# Altium schematic sheet UVW_Mosfets.SchDoc
size A4; SheetNumber: 2; SheetTotal: 6
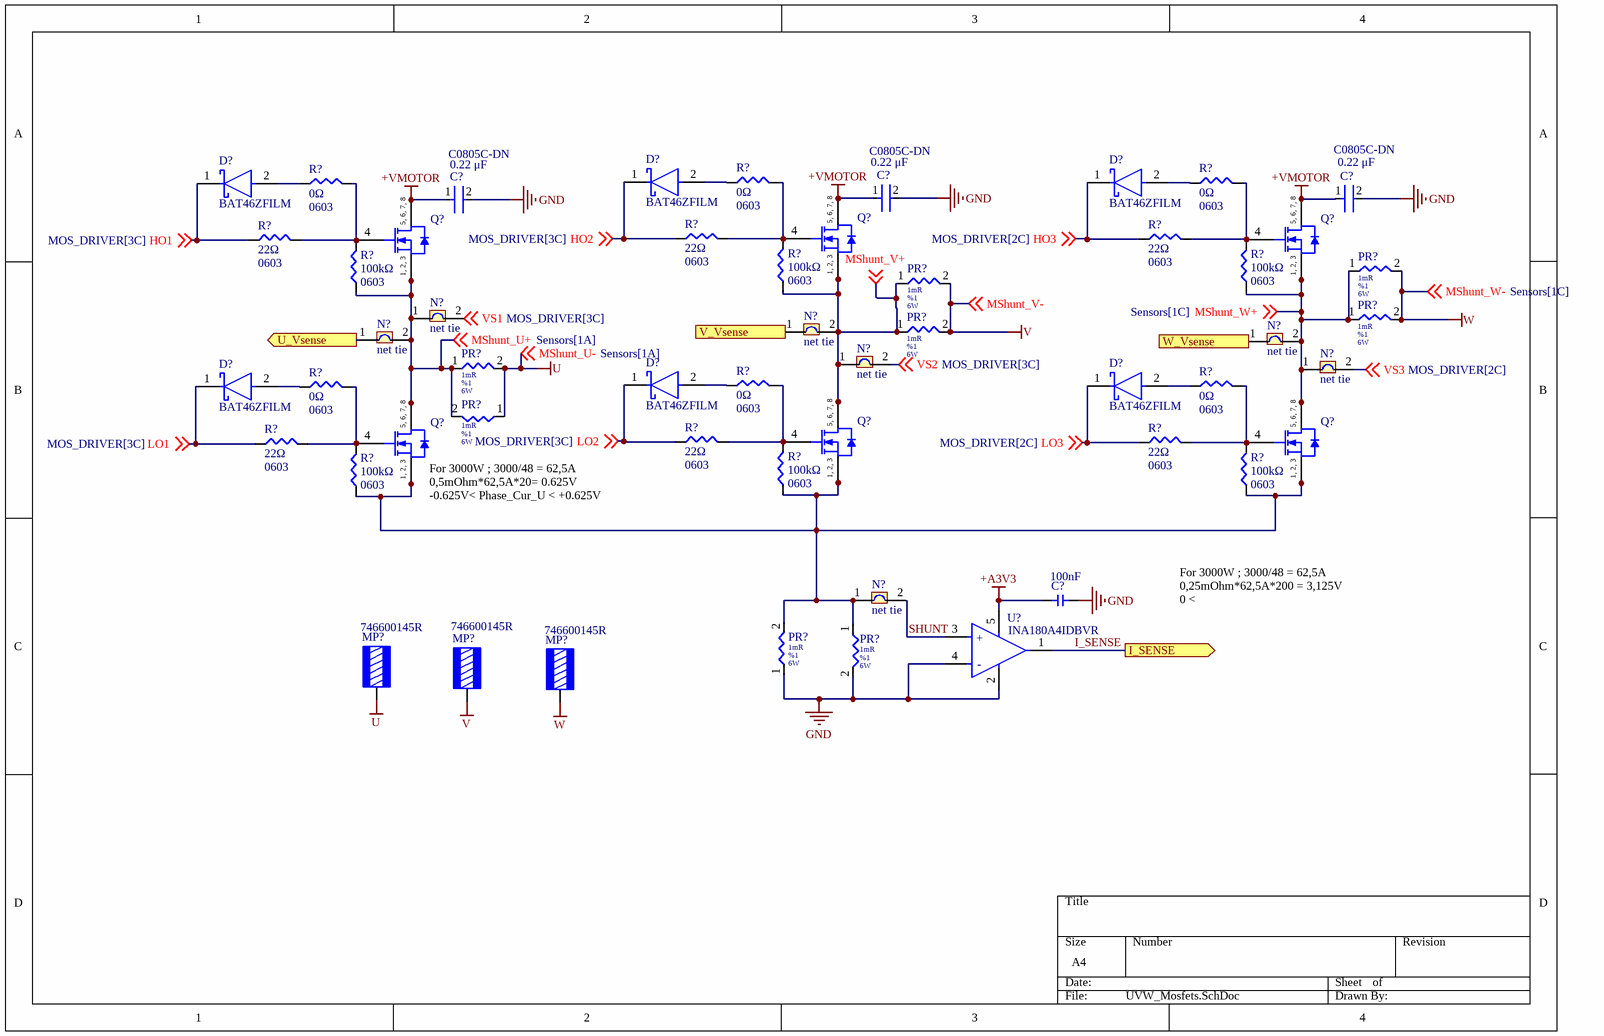
[diagram p0: UVW_Mosfets.SchDoc]

## Parts
(Parts that share a designator on the sheet are numbered #1, #2 ... from top to bottom, then left to right.)
C?#1  value 0.22 μF  Package: C0805C-DN  [FP-C0805C-DN-IPC_A]  (hidden comment: C0805C224K1RACTU)
C?#2  value 0.22 μF  Package: C0805C-DN  [FP-C0805C-DN-IPC_A]  (hidden comment: C0805C224K1RACTU)
C?#3  value 0.22 μF  Package: C0805C-DN  [FP-C0805C-DN-IPC_A]  (hidden comment: C0805C224K1RACTU)
C?#4  value 100nF  [0603_cap]  (hidden comment: 0603_100nF)
D?#1  BAT46ZFILM  [FP-SOD-123-MFG]
D?#2  BAT46ZFILM  [FP-SOD-123-MFG]
D?#3  BAT46ZFILM  [FP-SOD-123-MFG]
D?#4  BAT46ZFILM  [FP-SOD-123-MFG]
D?#5  BAT46ZFILM  [FP-SOD-123-MFG]
D?#6  BAT46ZFILM  [FP-SOD-123-MFG]
MP?#1  746600145R  [746600145]
MP?#2  746600145R  [746600145]
MP?#3  746600145R  [746600145]
N?#1  net tie  [net tie]  (net tie, no BOM)
N?#2  net tie  [net tie]  (net tie, no BOM)
N?#3  net tie  [net tie]  (net tie, no BOM)
N?#4  net tie  [net tie]  (net tie, no BOM)
N?#5  net tie  [net tie]  (net tie, no BOM)
N?#6  net tie  [net tie]  (net tie, no BOM)
N?#7  net tie  [net tie]  (net tie, no BOM)
PR?#1  value 1mR  Tolerance: %1  Power: 6W  [SMT-2512]  (hidden comment: EBWM2512F1L00S9)
PR?#2  value 1mR  Tolerance: %1  Power: 6W  [SMT-2512]  (hidden comment: EBWM2512F1L00S9)
PR?#3  value 1mR  Tolerance: %1  Power: 6W  [SMT-2512]  (hidden comment: EBWM2512F1L00S9)
PR?#4  value 1mR  Tolerance: %1  Power: 6W  [SMT-2512]  (hidden comment: EBWM2512F1L00S9)
PR?#5  value 1mR  Tolerance: %1  Power: 6W  [SMT-2512]  (hidden comment: EBWM2512F1L00S9)
PR?#6  value 1mR  Tolerance: %1  Power: 6W  [SMT-2512]  (hidden comment: EBWM2512F1L00S9)
PR?#7  value 1mR  Tolerance: %1  Power: 6W  [SMT-2512]  (hidden comment: EBWM2512F1L00S9)
PR?#8  value 1mR  Tolerance: %1  Power: 6W  [SMT-2512]  (hidden comment: EBWM2512F1L00S9)
Q?#1  TPH2R608NH,L1Q  [SOP Advance_TOS-L]  (value not drawn)
Q?#2  TPH2R608NH,L1Q  [SOP Advance_TOS-L]  (value not drawn)
Q?#3  TPH2R608NH,L1Q  [SOP Advance_TOS-L]  (value not drawn)
Q?#4  TPH2R608NH,L1Q  [SOP Advance_TOS-L]  (value not drawn)
Q?#5  TPH2R608NH,L1Q  [SOP Advance_TOS-L]  (value not drawn)
Q?#6  TPH2R608NH,L1Q  [SOP Advance_TOS-L]  (value not drawn)
R?#1  value 0Ω  Package: 0603  [0603-smd]  (hidden comment: 0603_0R)
R?#2  value 0Ω  Package: 0603  [0603-smd]  (hidden comment: 0603_0R)
R?#3  value 0Ω  Package: 0603  [0603-smd]  (hidden comment: 0603_0R)
R?#4  value 22Ω  Package: 0603  [0603-smd]  (hidden comment: 0603_22R)
R?#5  value 22Ω  Package: 0603  [0603-smd]  (hidden comment: 0603_22R)
R?#6  value 22Ω  Package: 0603  [0603-smd]  (hidden comment: 0603_22R)
R?#7  value 100kΩ  Package: 0603  [0603-smd]  (hidden comment: 0603_100K)
R?#8  value 100kΩ  Package: 0603  [0603-smd]  (hidden comment: 0603_100K)
R?#9  value 100kΩ  Package: 0603  [0603-smd]  (hidden comment: 0603_100K)
R?#10  value 0Ω  Package: 0603  [0603-smd]  (hidden comment: 0603_0R)
R?#11  value 0Ω  Package: 0603  [0603-smd]  (hidden comment: 0603_0R)
R?#12  value 0Ω  Package: 0603  [0603-smd]  (hidden comment: 0603_0R)
R?#13  value 22Ω  Package: 0603  [0603-smd]  (hidden comment: 0603_22R)
R?#14  value 22Ω  Package: 0603  [0603-smd]  (hidden comment: 0603_22R)
R?#15  value 22Ω  Package: 0603  [0603-smd]  (hidden comment: 0603_22R)
R?#16  value 100kΩ  Package: 0603  [0603-smd]  (hidden comment: 0603_100K)
R?#17  value 100kΩ  Package: 0603  [0603-smd]  (hidden comment: 0603_100K)
R?#18  value 100kΩ  Package: 0603  [0603-smd]  (hidden comment: 0603_100K)
U?  INA180A4IDBVR  [FP-DBV0005A-IPC_A]

## Ports
I_SENSE (out), U_Vsense (out), V_Vsense (out), W_Vsense (out)

## Nets
+A3V3: C?#4.1 U?.5(VS)
+VMOTOR: C?#1.1 C?#2.1 C?#3.1 Q?#1.5(DRAIN) Q?#1.6(DRAIN) Q?#1.7(DRAIN) Q?#1.8(DRAIN) Q?#2.5(DRAIN) Q?#2.6(DRAIN) Q?#2.7(DRAIN) Q?#2.8(DRAIN) Q?#3.5(DRAIN) Q?#3.6(DRAIN) Q?#3.7(DRAIN) Q?#3.8(DRAIN)
GND: C?#1.2 C?#2.2 C?#3.2 C?#4.2 PR?#7.2 PR?#8.1 U?.2(GND) U?.4(IN-)
U: MP?#1.1 PR?#5.2 PR?#6.1 ; off-sheet MShunt_U-  [also labelled MShunt_U-]
V: MP?#2.1 PR?#2.2 PR?#4.2 ; off-sheet MShunt_V-  [also labelled MShunt_V-]
W: MP?#3.1 PR?#1.2 PR?#3.2 ; off-sheet MShunt_W-  [also labelled MShunt_W-]
HO1: D?#1.1(C) R?#4.1 ; off-sheet HO1
HO2: D?#2.1(C) R?#5.1 ; off-sheet HO2
HO3: D?#3.1(C) R?#6.1 ; off-sheet HO3
I_SENSE: U?.1(OUT) ; port I_SENSE
LO1: D?#6.1(C) R?#13.1 ; off-sheet LO1
LO2: D?#4.1(C) R?#14.1 ; off-sheet LO2
LO3: D?#5.1(C) R?#15.1 ; off-sheet LO3
MShunt_U+: N?#1.1 N?#3.2 PR?#5.1 PR?#6.2 Q?#1.1(SOURCE) Q?#1.2(SOURCE) Q?#1.3(SOURCE) Q?#4.5(DRAIN) Q?#4.6(DRAIN) Q?#4.7(DRAIN) Q?#4.8(DRAIN) R?#7.1 ; off-sheet MShunt_U+
MShunt_V+: N?#2.2 N?#5.1 PR?#2.1 PR?#4.1 Q?#2.1(SOURCE) Q?#2.2(SOURCE) Q?#2.3(SOURCE) Q?#5.5(DRAIN) Q?#5.6(DRAIN) Q?#5.7(DRAIN) Q?#5.8(DRAIN) R?#8.1 ; off-sheet MShunt_V+
MShunt_W+: N?#4.2 N?#6.1 PR?#1.1 PR?#3.1 Q?#3.1(SOURCE) Q?#3.2(SOURCE) Q?#3.3(SOURCE) Q?#6.5(DRAIN) Q?#6.6(DRAIN) Q?#6.7(DRAIN) Q?#6.8(DRAIN) R?#9.1 ; off-sheet MShunt_W+
SHUNT: U?.3(IN+)
U_Vsense: N?#3.1 ; port U_Vsense
V_Vsense: N?#2.1 ; port V_Vsense
VS1: N?#1.2 ; off-sheet VS1
VS2: N?#5.2 ; off-sheet VS2
VS3: N?#6.2 ; off-sheet VS3
W_Vsense: N?#4.1 ; port W_Vsense
NetD?#1_2: D?#1.2(A) R?#1.1
NetD?#2_2: D?#2.2(A) R?#2.1
NetD?#3_2: D?#3.2(A) R?#3.1
NetD?#4_2: D?#4.2(A) R?#10.1
NetD?#5_2: D?#5.2(A) R?#11.1
NetD?#6_2: D?#6.2(A) R?#12.1
NetN?#7_1: N?#7.1 PR?#7.1 PR?#8.2 Q?#4.1(SOURCE) Q?#4.2(SOURCE) Q?#4.3(SOURCE) Q?#5.1(SOURCE) Q?#5.2(SOURCE) Q?#5.3(SOURCE) Q?#6.1(SOURCE) Q?#6.2(SOURCE) Q?#6.3(SOURCE) R?#16.1 R?#17.1 R?#18.1
NetQ?#1_4: Q?#1.4(GATE) R?#1.2 R?#4.2 R?#7.2
NetQ?#2_4: Q?#2.4(GATE) R?#2.2 R?#5.2 R?#8.2
NetQ?#3_4: Q?#3.4(GATE) R?#3.2 R?#6.2 R?#9.2
NetQ?#4_4: Q?#4.4(GATE) R?#12.2 R?#13.2 R?#16.2
NetQ?#5_4: Q?#5.4(GATE) R?#10.2 R?#14.2 R?#17.2
NetQ?#6_4: Q?#6.4(GATE) R?#11.2 R?#15.2 R?#18.2

Not connected (* = marked no-connect by the designer): N?#7 2

## Notes on the sheet
- (near Q?#4) For 3000W ; 3000/48 = 62,5A
  0,5mOhm*62,5A*20= 0.625V
  -0.625V< Phase_Cur_U < +0.625V
- For 3000W ; 3000/48 = 62,5A
  0,25mOhm*62,5A*200 = 3,125V
  0 < @{"Id":"UGEDVJUL\KTVDSUUQ"} < 3,125V
- (in symbol CMP-04895-000244-1) +; -
- (in symbol TPH2R608NH,L1Q) 5, 6, 7, 8; 1, 2, 3

## Library data of the parts
C?#1-C?#3 = CMP-2007-03262-2: CAP CER 0.22UF 100V 10% X7R 0805; Manufacturer: KEMET; Material: Ceramic; Tolerance: 0.1; Temperature Coefficient: 30ppm/°C; Temperature Range High: +125°C; Temperature Range Low: -55°C; Voltage Rating: 100 V; Device Class L2: Capacitors; Manufacturer Part Number: C0805C224K1RACTU; Octopart: https://octopart.com/c0805c224k1ractu-kemet-12818106; ComponentLink2URL: https://content.kemet.com/datasheets/KEM_C1003_C0G_SMD.pdf; RoHS: TRUE; Temperature: -55°C to +125°C; Ipc Land Pattern Name: CAPC200125X78; Category: Cap; ComponentLink2Description: Datasheet; Height: 0.88mm; Device Class L1: Passive Components; Digikey Description: CAP CER 0.22UF 100V 10% X7R 0805; Mouser Description: 0805 C 220nF Ceramic Multilayer Capacitor, 100 V, +125degC, X7R Dielec, +/-10%; Capacitance: 0.22 μF; Lead Free: Yes; Automotive: No; Temperature Characteristic: X7R; Device Class L3: Ceramic Capacitors
C?#4 = 0603_100nF: Volt: V; Package: 0603
D?#1-D?#6 = CMP-12187-000006-1: DIODE SCHOTTKY 100V 150MA SOD123; Manufacturer: STMicroelectronics; Max Surge Forward Current: 1A; Capacitance: 10pF; Standoff Height: 0mm; Peak Reverse Current: 5uA; Value: 10pF; Max Junction Temp: +150°C; Automotive: No; Ipc Land Pattern Name: SOD375155X145-2; Device Class L2: Diodes; Device Class L1: Discrete Semiconductors; Temperature Range High: +150°C; ComponentLink2Description: Datasheet; Lead Free: Yes; Digikey Description: DIODE SCHOTTKY 100V 150MA SOD123; RoHS: TRUE; Category: Diode; Max Repetitive Reverse Voltage: 100V; ComponentLink2URL: https://www.st.com/resource/en/datasheet/bat46.pdf; Manufacturer Part Number: BAT46ZFILM; Temperature: to +150°C; Mouser Description: Schottky Diodes & Rectifiers schottky diode; Package: SOD-123; Forward Current: 150mA; Octopart: https://octopart.com/bat46zfilm-stmicroelectronics-658190; Height: 1.45mm; Device Class L3: Schottky Diodes
MP?#1-MP?#3 = CMP-03913-99674487-1: 746600145R SMT REDCUBE Bush Reverse with Through Hole, 4.5 mm Ø Internal Hole, 86A, Vertical, WP-SMRT; Current Rating: 85A; RoHS: Compliant; Min Operating Temperature: -55°C; Max Operating Temperature: 150°C; Height: 3mm; Packaging: Tape and Reel; NexarPartId: 99674487; Material: Brass
PR?#1-PR?#8 = EBWM2512F1L00S9: Res 0.001 Ohm 1% 6W 2512; Manufacturer: Resion; Supplier 1: Digikey; Manufacturer Part Number: EBWM2512F1L00S9; RoHS: No; Category: Chip SMD Resistors; Stock 1: 17222; Pricing 1: 1=0,79, 10=0,449, 50=0,3226, 100=0,2829, 500=0,21686, 1000=0,19594 (USD); Supplier Part Number 1: 4506-EBWM2512F1L00S9CT-ND
Q?#1-Q?#6 = TPH2R608NH,L1Q: X35 Pb-F Power Mosfet Transistor Sop8-Adv Pd=142 W F=1Mhz; Mfr_Name: Toshiba Electronic Devices & Storage Corp.; Manufacturer: Toshiba; Continuous Drain Current (ID): 150A; Drain to Source Voltage (Vdss): 75V; Rds On Max: 2.6mR; Input Capacitance: 6nF; Max Power Dissipation: 142W; Type: Transistors; RefDes: RefDes; Supplier 1: Arrow Electronics; Manufacturer Part Number: TPH2R608NH,L1Q; RoHS: Yes; Category: MOSFETs; Stock 1: 59; Pricing 1: 1=1,2931, 10=1,0206, 25=0,5906 (USD); Mounting Technology: Surface Mount; Pins: 8; Packaging: Tape and Reel; ComponentLink1URL: http://www.mouser.com/ds/2/408/TPH2R608NH_datasheet_en_20150123-768911.pdf?src-supplier=Mouser; ComponentLink1Description: http://www.mouser.com/ds/2/408/TPH2R608NH_datasheet_en_20150123-768911.pdf?src-supplier=Mouser; ComponentLink2URL: https://toshiba.semicon-storage.com/info/docget.jsp?did=15733&prodName=TPH2R608NH&src-supplier=Digikey; ComponentLink2Description: https://toshiba.semicon-storage.com/info/docget.jsp?did=15733&prodName=TPH2R608NH&src-supplier=Digikey; Supplier Part Number 1: TPH2R608NH,L1Q
R?#1-R?#3 R?#10-R?#12 = 0603_0R: Power: W
R?#4-R?#6 R?#13-R?#15 = 0603_22R: Power: W
R?#7-R?#9 R?#16-R?#18 = 0603_100K: Power: W
U? = CMP-04895-000244-1: IC CURR SENSE 1 CIRCUIT SOT23-5; Operating Supply Current: 260uA; Number of Circuits: 1; Input Bias Current: 100nA; -3db Bandwidth: 350kHz; Input Offset Voltage (Vos): 100uV; Slew Rate: 2V/µs; Case/Package: SOT-23-5; Min Operating Temperature: -40°C; Packaging: Tape and Reel; Max Operating Temperature: 125°C; Mount: Surface Mount; RoHS Compliant: Yes